# EasyEDA Pro project ProProject_powerboard_ssl_philipp_2023-09-25.epro, schematic Schematic1_9

## Sheets
1 P1: Create Date: 2022-11-08; Page Name: P1; Project Name: powerboard_ssl_philipp; Schematic Name: Schematic1_8; Update Date: 2023-06-18; Company: 嘉立创EDA; Page Size: A4; Version: V1.0
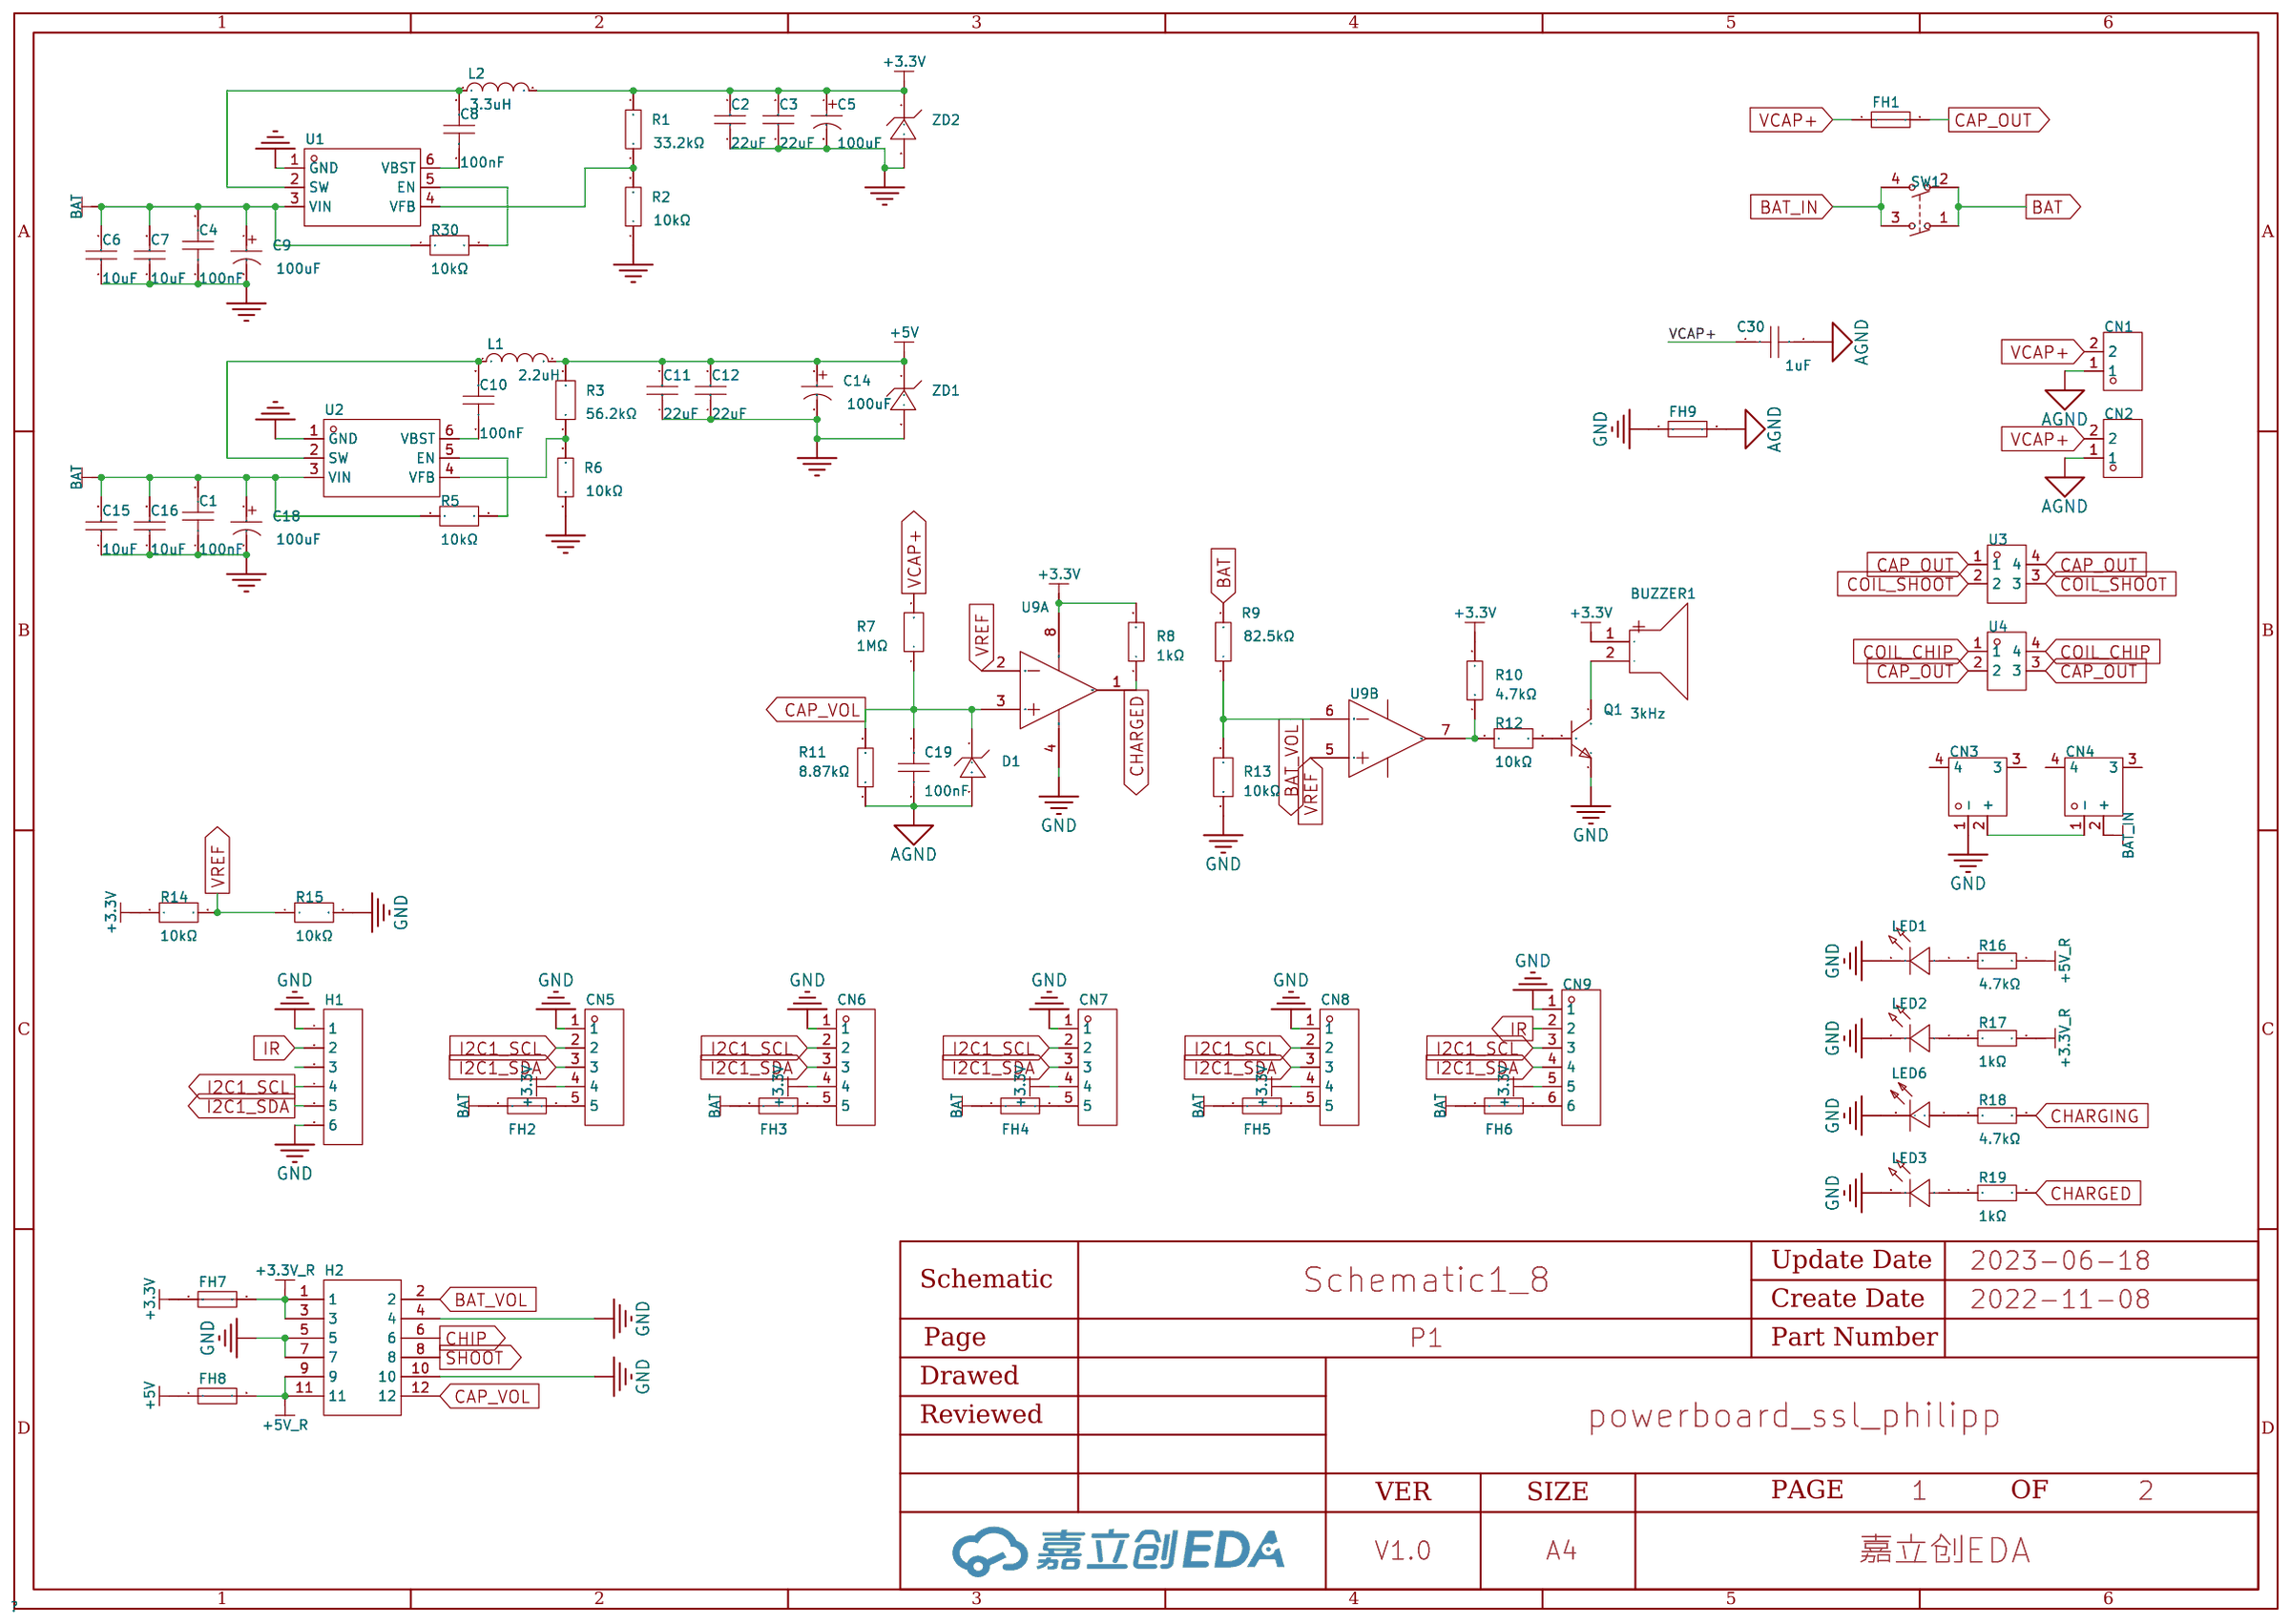
[diagram p6: P1]
2 P2: Create Date: 2022-11-11; Page Name: P2; Schematic Name: Schematic1_9; Update Date: 2023-07-16
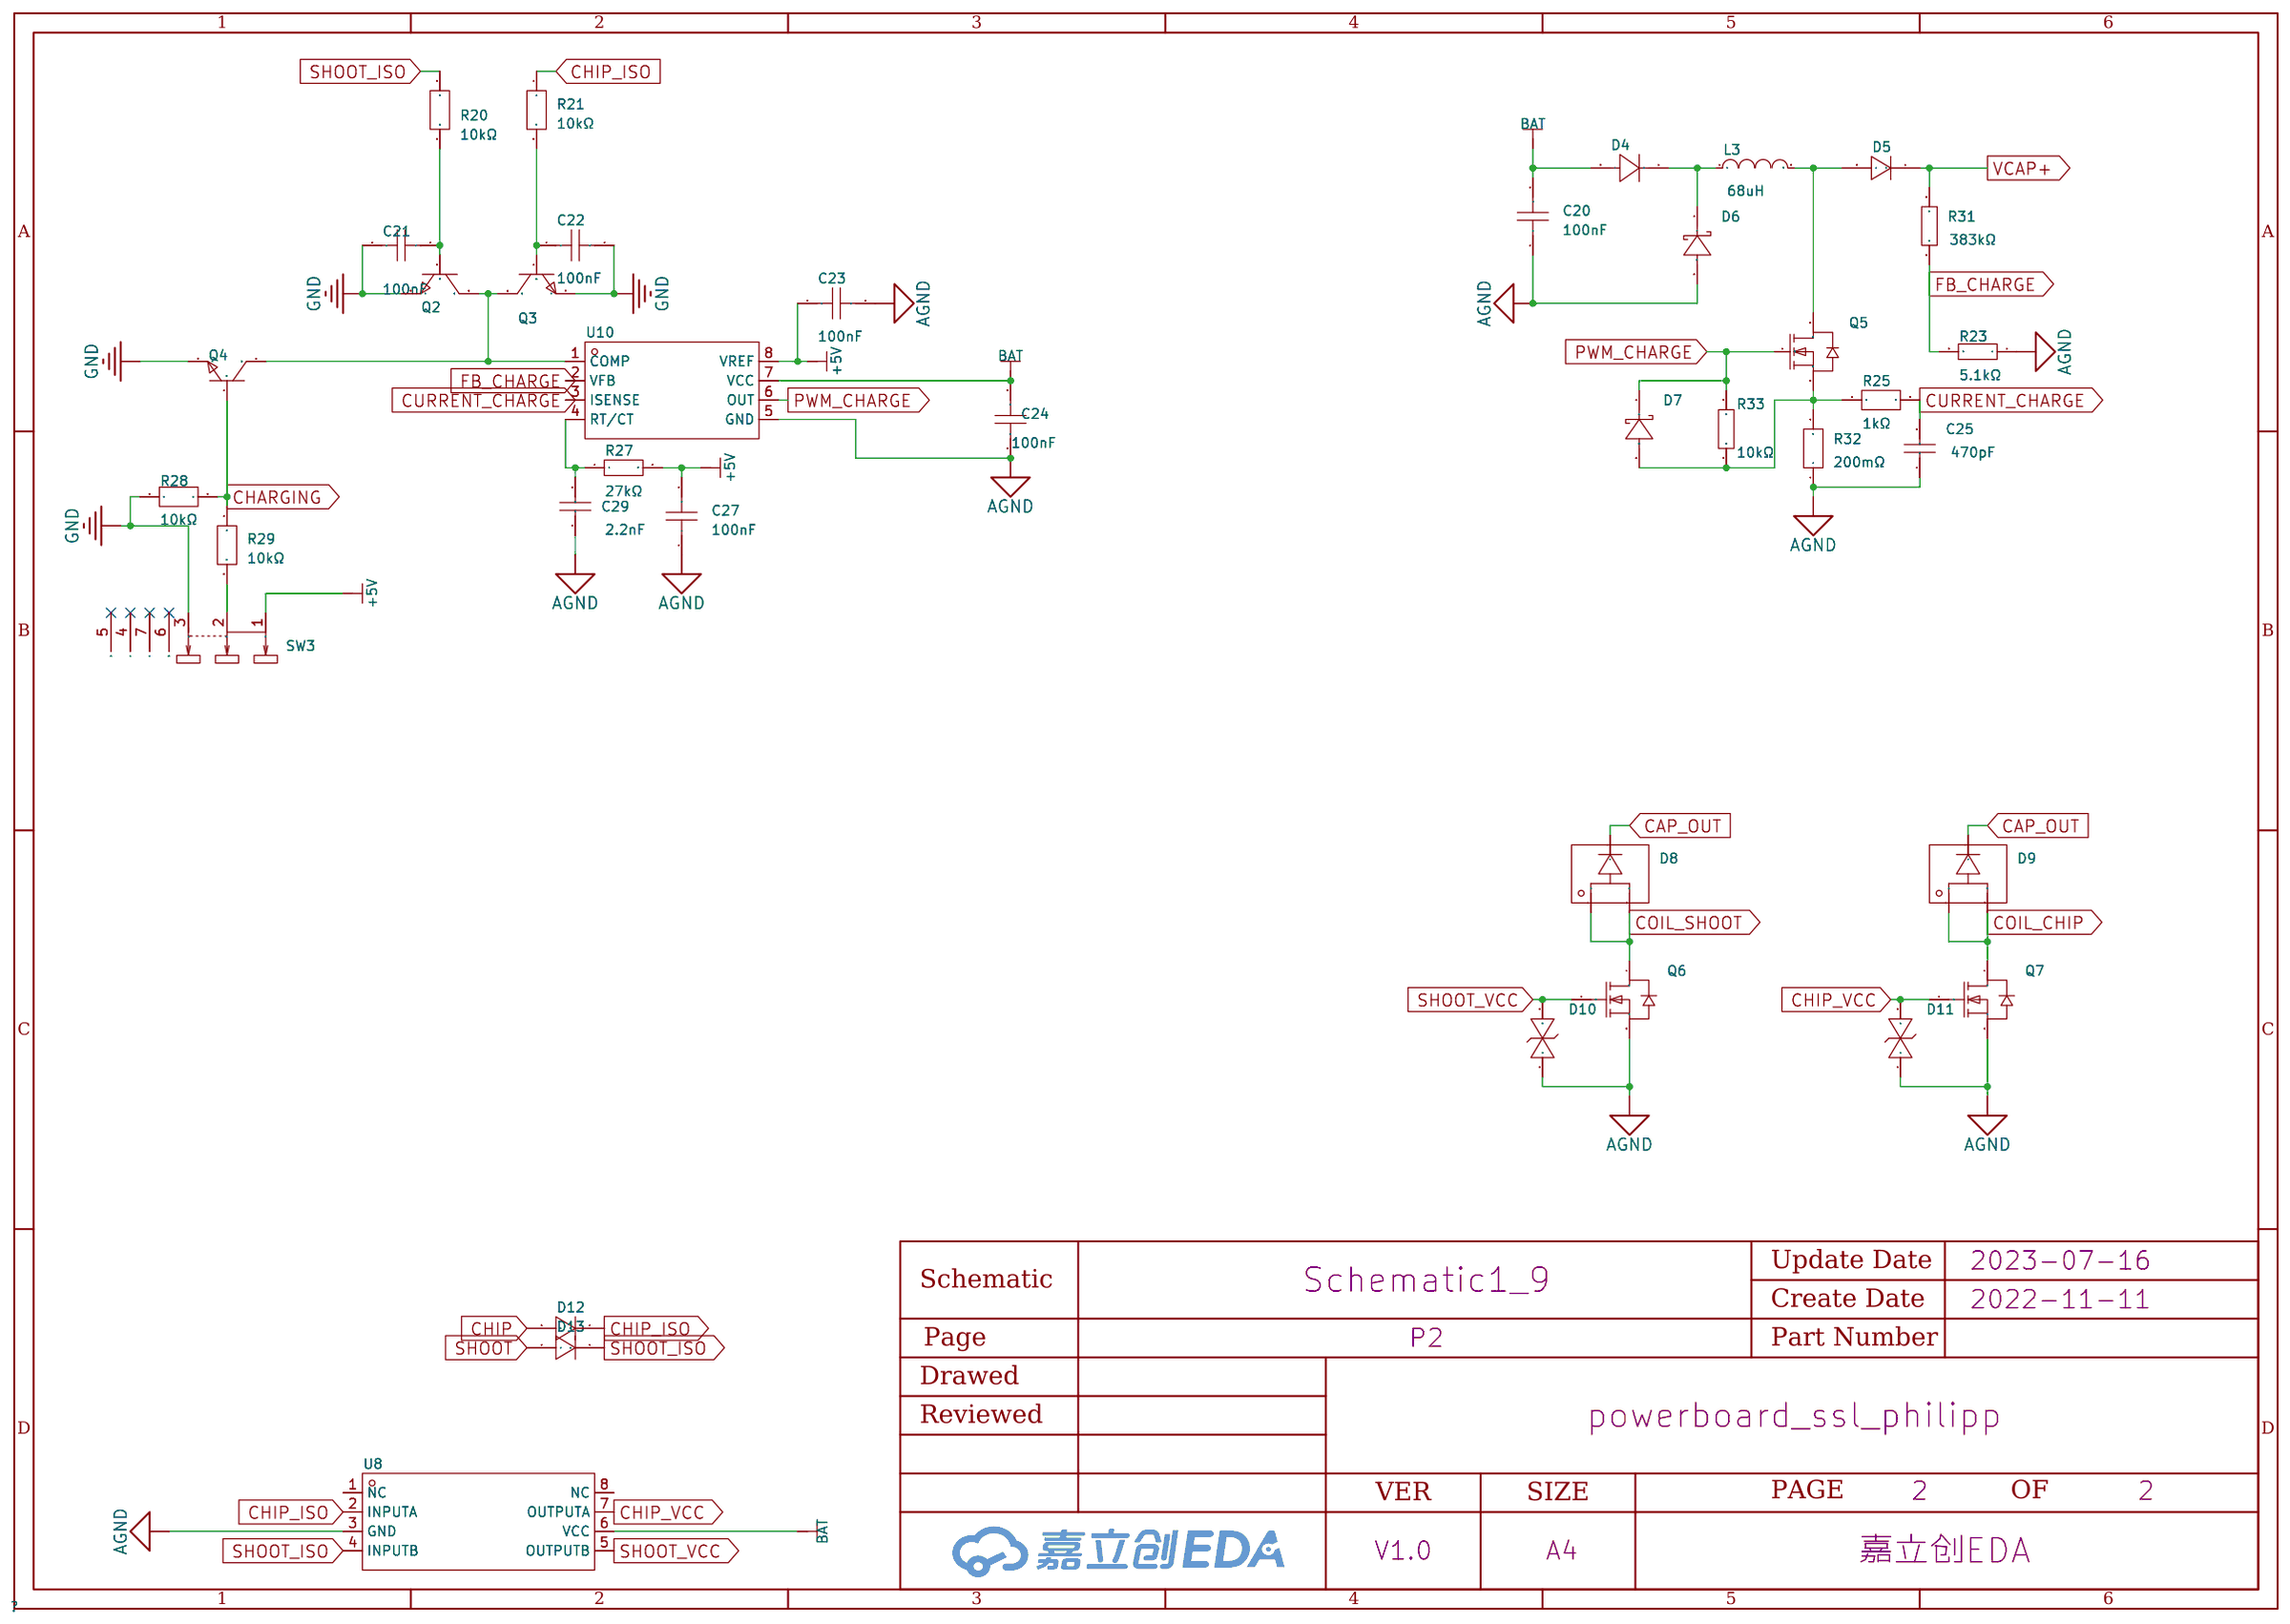
[diagram p7: P2]

## Parts
sheet P1
BUZZER1  3kHz  [BUZ-TH_BD9.0-P5.00-D0.6-FD]
C1  100nF  [C0805]
C2  22uF  [C0805]
C3  22uF  [C0805]
C4  100nF  [C0805]
C5  100uF  [CAP-TH_BD5.0-P2.00-D0.8-FD]
C6  10uF  [C0805]
C7  10uF  [C0805]
C8  100nF  [C0805]
C9  100uF  [CAP-TH_BD5.0-P2.00-D0.8-FD]
C10  100nF  [C0805]
C11  22uF  [C0805]
C12  22uF  [C0805]
C14  100uF  [CAP-TH_BD5.0-P2.00-D0.8-FD]
C15  10uF  [C0805]
C16  10uF  [C0805]
C18  100uF  [CAP-TH_BD5.0-P2.00-D0.8-FD]
C19  100nF  [C0805]
C30  1uF  [C1812]
CN1  OQ0254510000G  [CONN-TH_2P-P25.08_OQ0254510000G]
CN2  OQ0254510000G  [CONN-TH_2P-P25.08_OQ0254510000G]
CN3  XT60PW-M  [CONN-TH_XT60PW-M]
CN4  XT60PW-M  [CONN-TH_XT60PW-M]
CN5  5264-5AWD米色  [CONN-TH_5P-P2.50_5264-5AWD]
CN6  5264-5AWD米色  [CONN-TH_5P-P2.50_5264-5AWD]
CN7  5264-5AWD米色  [CONN-TH_5P-P2.50_5264-5AWD]
CN8  5264-5AWD米色  [CONN-TH_5P-P2.50_5264-5AWD]
CN9  HC-5264-6AW  [CONN-TH_6P-P2.50_HCTL_HC-5264-6AW]
D1  SMF3.3A  [SOD-123_L2.8-W1.8-LS3.7-RD]
FH1  01550900M  [FUSE-SMD_L9.8-W5.0]
FH2  01550900M  [FUSE-SMD_L9.8-W5.0]
FH3  01550900M  [FUSE-SMD_L9.8-W5.0]
FH4  01550900M  [FUSE-SMD_L9.8-W5.0]
FH5  01550900M  [FUSE-SMD_L9.8-W5.0]
FH6  01550900M  [FUSE-SMD_L9.8-W5.0]
FH7  01550900M  [FUSE-SMD_L9.8-W5.0]
FH8  01550900M  [FUSE-SMD_L9.8-W5.0]
FH9  01550900M  [FUSE-SMD_L9.8-W5.0]
H1  2.54-1x6P直针  [HDR-TH_6P-P2.54-V-M-1]
H2  A2541WV-2x6P  [HDR-TH_12P-P2.54-V-M-R2-C6-S2.54]
L1  2.2uH  [IND-SMD_L6.5-W6.5_IHLP-2525]
L2  3.3uH  [IND-SMD_L6.5-W6.5_IHLP-2525]
LED1  MHS171UBCT  [LED-SMD_L2.1-W1.0-R-RD]
LED2  MHS171UBCT  [LED-SMD_L2.1-W1.0-R-RD]
LED3  MHS171UBCT  [LED-SMD_L2.1-W1.0-R-RD]
LED6  SZYY0805B  [LED0805-R-RD_BLUE]
Q1  SS8050  [SOT-23-3_L2.9-W1.3-P1.90-LS2.4-BR]
R1  33.2kΩ  [R0805]
R2  10kΩ  [R0805]
R3  56.2kΩ  [R0805]
R5  10kΩ  [R0805]
R6  10kΩ  [R0805]
R7  1MΩ  [R0805]
R8  1kΩ  [R0805]
R9  82.5kΩ  [R0805]
R10  4.7kΩ  [R0805]
R11  8.87kΩ  [R0805]
R12  10kΩ  [R0805]
R13  10kΩ  [R0805]
R14  10kΩ  [R0805]
R15  10kΩ  [R0805]
R16  4.7kΩ  [R0805]
R17  1kΩ  [R0805]
R18  4.7kΩ  [R0805]
R19  1kΩ  [R0805]
R30  10kΩ  [R0805]
SW1  SS21-BBIWP2-R  [SW-TH_SS21-BBIWP2]
U1  TPS565208DDCR  [TSOT-23-6_L2.9-W1.6-P0.95-LS2.8-BR]
U2  TPS565208DDCR  [TSOT-23-6_L2.9-W1.6-P0.95-LS2.8-BR]
U3  2061-602/998-404  [CONN-SMD_2061-602-998-404]
U4  2061-602/998-404  [CONN-SMD_2061-602-998-404]
U9  LM393  [SOP-8_L4.9-W3.9-P1.27-LS6.0-BL]  (sections 1,2)
ZD1  BZT52C5V1  [SOD-123_L2.8-W1.8-LS3.7-RD]
ZD2  BZT52C3V3  [SOD-123_L2.8-W1.8-LS3.7-RD]
sheet P2
C20  100nF  [C0805]
C21  100nF  [C0805]
C22  100nF  [C0805]
C23  100nF  [C0805]
C24  100nF  [C0805]
C25  470pF  [C1206]
C27  100nF  [C0805]
C29  2.2nF  [C0805]
D4  GS2M  [SMB_L4.5-W3.6-LS5.4-RD]
D5  ES5EBF  [SMBF_L4.3-W3.6-LS5.3-RD]
D6  SMBJ18A  [SMB_L4.4-W3.6-LS5.4-RD]
D7  SMBJ18A  [SMB_L4.4-W3.6-LS5.4-RD]
D8  MBRB40250TG  [D2PAK_L9.1-W10.0-P2.54-LS15.3-BR]
D9  MBRB40250TG  [D2PAK_L9.1-W10.0-P2.54-LS15.3-BR]
D10  SMBJ17CA  [SMB_L4.6-W3.6-LS5.3-BI]
D11  SMBJ17CA  [SMB_L4.6-W3.6-LS5.3-BI]
D12  SS52  [SMB_L4.6-W3.6-LS5.3-RD]
D13  SS52  [SMB_L4.6-W3.6-LS5.3-RD]
L3  68uH  [IND-SMD_L14.4-W12.8]
Q2  SS8050  [SOT-23-3_L2.9-W1.3-P1.90-LS2.4-BR]
Q3  SS8050  [SOT-23-3_L2.9-W1.3-P1.90-LS2.4-BR]
Q4  SS8050  [SOT-23-3_L2.9-W1.3-P1.90-LS2.4-BR]
Q5  HSU16N25  [TO-252-2_L6.5-W5.6-P4.60-LS9.7-BR-2]
Q6  IRFS4229TRLPBF  [D2PAK_L9.1-W10.0-P2.54-LS15.3-TL]
Q7  IRFS4229TRLPBF  [D2PAK_L9.1-W10.0-P2.54-LS15.3-TL]
R20  10kΩ  [R0805]
R21  10kΩ  [R0805]
R23  5.1kΩ  [R1206]
R25  1kΩ  [R1206]
R27  27kΩ  [R1206]
R28  10kΩ  [R0805]
R29  10kΩ  [R0805]
R31  383kΩ  [R1206]
R32  200mΩ  [RES-SMD_L6.4-W3.2-R2512]
R33  10kΩ  [R1206]
SW3  K3-1296S-E1  [SW-TH_K3-1296S-E1]
U8  MC34152DG  [SOIC-8_L5.0-W4.0-P1.27-LS6.0-BL]
U10  UC3843BM/TR  [SOP-8_L4.9-W3.9-P1.27-LS6.0-BL]

## Library data of the parts
BUZZER1 = HNB09A03: 驱动方式:电磁式;构造类型:有源;额定电压:3V;工作电压:1.5V~4.5V;消耗电流:30mA;频率:3kHz;声压(SPL):85dB@10cm;直径(φD):9mm;长度:-;宽度:-;高度:5.5mm;工作温度:-20~+70;; LCSC Part Name: 电磁式有源一体蜂鸣器HNB09A03; Supplier Part: C96102; Manufacturer: 华能; Supplier Footprint: 插件,P=5mm; JLCPCB Part Class: Extended Part; Datasheet: https://atta.szlcsc.com/upload/public/pdf/source/20170522/1495448326172.pdf; Supplier: LCSC; Oscillator Circuit: 电磁式; Technology Type: 有源; Rated Voltage: 3V; Operating Voltage: 1.5V~4.5V; Current Consumption: 30mA; Sound Pressure Level (SPL): 85dB@10cm; Diameter (φD): 9mm; Height: 5.5mm; Operating Temperature: -20~+70
C1 C4 C8 C10 C19-C24 C27 = C0805X104K101T: 温度系数:X7R;容值:100nF;精度:±10%;额定电压:100V;; LCSC Part Name: 100nF(104) ±10% 100V; Supplier Part: C485772; Manufacturer: IHHEC(禾伸堂); Supplier Footprint: 0805; JLCPCB Part Class: Extended Part; Datasheet: https://atta.szlcsc.com/upload/public/pdf/source/20200117/C485772_1C2A03D89DC7D3F931FB9AFBA2903E68.pdf; Supplier: LCSC; Temperature Coefficient: X7R; Tolerance: ±10%; Voltage Rated: 100V
C2 C3 C11 C12 = GRM21BR61E226ME44L: 容值:22uF;精度:±20%;额定电压:25V;材质(温度系数):X5R;; LCSC Part Name: 22uF ±20% 25V; Supplier Part: C86816; Manufacturer: muRata(村田); Supplier Footprint: 0805; JLCPCB Part Class: Extended Part; Datasheet: https://atta.szlcsc.com/upload/public/pdf/source/20161226/1482720145536.pdf; Supplier: LCSC; Tolerance: ±20%; Voltage Rated: 25V; Temperature Coefficient: X5R
C5 C9 C14 C18 = 25YXJ100M5X11: 容值:100uF;精度:±20%;额定电压:25V;电容体直径:5mm;电容体长度:11mm;脚间距:2mm;纹波电流:250mA@100kHz;等效串联电阻:400mΩ@100kHz;工作寿命:5000hrs@105℃;; LCSC Part Name: 100uF ±20% 25V; Supplier Part: C108360; Manufacturer: rubycon(红宝石); Supplier Footprint: 插件,D5xL11mm; JLCPCB Part Class: Extended Part; Datasheet: https://atta.szlcsc.com/upload/public/pdf/source/20170418/1492506330752.pdf; Supplier: LCSC; Tolerance: ±20%; Rated Voltage: 25V; φD: 5mm; L: 11mm; Lead Spacing: 2mm; Ripple Current: 250mA@100kHz; Equivalent Series Resistance(ESR): 400mΩ@100kHz; Lifetime @ Temp: 5000hrs@105℃
C6 C7 C15 C16 = CL21A106KAYNNNE_C15850: 容值:10uF;精度:±10%;额定电压:25V;温度系数:X5R;; LCSC Part Name: 10uF ±10% 25V; Supplier Part: C15850; Manufacturer: SAMSUNG(三星); Manufacturer Part: CL21A106KAYNNNE; Supplier Footprint: 0805; JLCPCB Part Class: Basic Part; Datasheet: https://atta.szlcsc.com/upload/public/pdf/source/20160103/1457707679302.pdf; Supplier: LCSC; Tolerance: ±10%; Voltage Rated: 25V; Temperature Coefficient: X5R
C30 = FS43X105K251EGG: 容值:1uF;精度:±10%;额定电压:250V;材质(温度系数):X7R;; LCSC Part Name: 1uF ±10% 250V; Supplier Part: C381468; Manufacturer: PSA(信昌电陶); Supplier Footprint: 1812; JLCPCB Part Class: Extended Part; Datasheet: https://atta.szlcsc.com/upload/public/pdf/source/20190402/C381468_E502B8CF017A3D98B4DF4698605C68CE.pdf; Supplier: LCSC; Tolerance: ±10%; Voltage Rated: 250V; Temperature Coefficient: X7R
CN1 CN2 = OQ0254510000G: 参考系列:-;间距:5.08mm;插针结构:1x2P;排数:1;每排PIN数:2;行距:-;公母:公型插针;安装方式:弯插;额定电流:20A;工作温度范围:-40~+115;; LCSC Part Name: 2P 5.08mm; Supplier Part: C599410; Manufacturer: Amphenol; Supplier Footprint: 插件,P=5.08mm; JLCPCB Part Class: Extended Part; Datasheet: https://atta.szlcsc.com/upload/public/pdf/source/20210316/C599410_EA23387B2F1C07023878CDA6296B3C6F.pdf; Supplier: LCSC; Pitch: 5.08mm; Pins Structure: 1x2P; Number of Rows: 1; Number of PINs Per Row: 2; Gender: 公型插针; Mounting Style: 弯插; Current Rating (Max): 20A; Operating Temperature Range: -40~+115
CN3 CN4 = XT60PW-M: 模型锂电连接器; LCSC Part Name: XT60PW 公头 板插卧式; Supplier Part: C98732; Manufacturer: AMASS(艾迈斯); Supplier Footprint: Through Hole; JLCPCB Part Class: Extended Part; Datasheet: https://atta.szlcsc.com/upload/public/pdf/source/20180125/C98732_15168617837851301983.pdf; Supplier: LCSC
CN5-CN8 = 5264-5AWD米色: 参考系列:-;间距:2.5mm;插针结构:1x5P;排数:1;每排PIN数:5;行距:-;安装方式:-;触头材质:磷青铜;; LCSC Part Name: 5264插座 1*5P 弯针 带定位; Supplier Part: C176652; Manufacturer: BOOMELE(博穆精密); Supplier Footprint: 插件,P=2.5mm; JLCPCB Part Class: Extended Part; Datasheet: https://atta.szlcsc.com/upload/public/pdf/source/20180125/C176652_15168701824541304803.pdf; Supplier: LCSC; Pitch: 2.5mm; Pins Structure: 1x5P; Number of Rows: 1; Number of PINs Per Row: 5; Contact Material: 磷青铜
CN9 = HC-5264-6AW: 参考系列:-;间距:2.5mm;插针结构:1x6P;排数:1;每排PIN数:6;行距:-;公母:公型插针;安装方式:弯插;额定电流:3A;工作温度范围:-25~+85;; LCSC Part Name: 2.5mm 1x6P 弯插; Supplier Part: C2845829; Manufacturer: HCTL(华灿天禄); Supplier Footprint: 弯插,P=2.5mm; JLCPCB Part Class: Extended Part; Datasheet: https://atta.szlcsc.com/upload/public/pdf/source/20210728/C2845825_8A371A7E0B3DBB1209B365938FCC7945.pdf; Supplier: LCSC; Pitch: 2.5mm; Pins Structure: 1x6P; Number of Rows: 1; Number of PINs Per Row: 6; Gender: 公型插针; Mounting Style: 弯插; Current Rating (Max): 3A; Operating Temperature Range: -25~+85
D1 = SMF3.3A: 极性:单向;反向截止电压(Vrwm):3.3V;击穿电压(最小值):5.2V;击穿电压(最大值):6V;反向漏电流(Ir):600A;峰值脉冲电流(Ipp)@10/1000s:25A;最大钳位电压:8V;峰值脉冲功率(Ppp)@10/1000s:200W;; LCSC Part Name: 单向 3.3V 200W; Supplier Part: C283866; Manufacturer: DOWO(东沃); Supplier Footprint: SOD-123; JLCPCB Part Class: Extended Part; Datasheet: https://atta.szlcsc.com/upload/public/pdf/source/20180913/C283866_6B3FC7DB82D40F63EC323F6A8CE1774A.pdf; Supplier: LCSC; Polarity: 单向; Reverse Stand-Off Voltage (Vrwm): 3.3V; Breakdown Voltage (Min): 5.2V; Breakdown Voltage (Max): 6V; Reverse Leakage Current (Ir): 600A; Peak Pulse Current (Ipp)@10/1000μs: 25A; Maximum Clamping Voltage: 8V; Peak Pulse Power Dissipation (Ppp)@10/1000μs: 200W
FH1 FH7-FH9 = 01550900M: 保险丝座类型:-;保险丝类型:-;配套使用产品/相关产品:-;保险丝尺寸:-;电路数:-;; Supplier Part: C108518; Manufacturer: Littelfuse(美国力特); Supplier Footprint: SMD,9.73x5.03mm; JLCPCB Part Class: Extended Part; Datasheet: https://atta.szlcsc.com/upload/public/pdf/source/20180709/C108518_633006668DA33DEF5C52F8FE2F1C83D6.pdf; Supplier: LCSC
FH2-FH6 = 01550900M: 保险丝座类型:-;保险丝类型:-;保险丝尺寸:-;; Supplier Part: C108518; Manufacturer: Littelfuse(美国力特); Supplier Footprint: SMD,9.73x5.03mm; JLCPCB Part Class: Extended Part; Datasheet: https://atta.szlcsc.com/upload/public/pdf/source/20180709/C108518_633006668DA33DEF5C52F8FE2F1C83D6.pdf; Supplier: LCSC
H1 = 2.54-1x6P直针: 间距:2.54mm;总PIN位数:6;排数:1;插针结构:1x6P;行距:-;安装类型:直插;圆针/方针:方针;额定电流:3A;额定电压:-;配合针长度:-;塑高:-;触头材质:黄铜;触头镀层:-;工作温度范围:-40~+105;颜色:黑色;; LCSC Part Name: 2.54mm 1x6P 直插 方针; Supplier Part: C37208; Manufacturer: BOOMELE(博穆精密); Supplier Footprint: 直插,P=2.54mm; JLCPCB Part Class: Extended Part; Datasheet: https://atta.szlcsc.com/upload/public/pdf/source/20151109/1457707558014.pdf; Supplier: LCSC; Pitch: 2.54mm; Number of Pins: 6; Number of Rows: 1; Pin Structure: 1x6P; Mounting Type: 直插; Circluar Pins/Square Pins: 方针; Current Rating (Max): 3A; Contact Material: 黄铜; Operating Temperature Range: -40~+105; Color: 黑色
H2 = A2541WV-2x6P: 间距:2.54mm;总PIN位数:12;排数:2;插针结构:2x6P;行距:2.54mm;安装类型:直插;圆针/方针:方针;额定电流:-;额定电压:-;配合针长度:6mm;塑高:2.54mm;端接针长度:3mm;触头材质:黄铜;触头镀层:-;工作温度范围:-40~+105;颜色:黑色;; LCSC Part Name: 2.54mm 2x6P 直插 方针 镀金; Supplier Part: C225521; Manufacturer: CJT(长江连接器); Supplier Footprint: 插件,P=2.54mm; JLCPCB Part Class: Extended Part; Datasheet: https://atta.szlcsc.com/upload/public/pdf/source/20180509/C225521_5ACF74447E0551B122D29D93138E3088.pdf; Supplier: LCSC; Pitch: 2.54mm; Number of Pins: 12; Number of Rows: 2; Pin Structure: 2x6P; Row Spacing: 2.54mm; Mounting Type: 直插; Circluar Pins/Square Pins: 方针; Length of Mating Pin: 6mm; Insulation Height: 2.54mm; Length of End Connection Pin: 3mm; Contact Material: 黄铜; Operating Temperature Range: -40~+105; Color: 黑色
L1 = IHLP2525CZER2R2M01: 电感值:2.2uH;精度:±20%;额定电流:8A;饱和电流(Isat):14A;直流电阻(DCR):18mΩ;; LCSC Part Name: 2.2uH ±20% 14A 18mΩ; Supplier Part: C540967; Manufacturer: VISHAY(威世); Supplier Footprint: 2525; JLCPCB Part Class: Extended Part; Datasheet: https://atta.szlcsc.com/upload/public/pdf/source/20200518/C540965_C44D252D9586BC7DBEB4AC22742EA8B7.pdf; Supplier: LCSC; Tolerance: ±20%; Rated Current: 8A; Saturation Current (Isat): 14A; DC Resistance (DCR): 18mΩ; Frequency - Self Resonant: 38MHz
L2 = IHLP2525CZER3R3M01: 电感值:3.3uH;精度:±20%;额定电流:6A;直流电阻(DCR):28mΩ;; LCSC Part Name: 3.3uH ±20% 6A 28mΩ; Supplier Part: C506574; Manufacturer: VISHAY(威世); Supplier Footprint: SMD; JLCPCB Part Class: Extended Part; Datasheet: https://atta.szlcsc.com/upload/public/pdf/source/20200402/C506576_682BA61D3692E8732F3F8433B2832F66.pdf; Supplier: LCSC; Tolerance: ±20%; Rated Current: 6A; DC Resistance (DCR): 28mΩ
LED1-LED3 = MHS171UBCT: 发光颜色:蓝灯;二极管配置:-;透镜颜色:无色透明;主波长:467nm~476nm;峰值波长:468nm;色温:-;光通量(25时):-;测试电流:5mA;正向电压(VF):3.1V;发光强度:90mcd;功率:75mW;发光角度:140°;安装方式:侧贴;工作温度:-40~+85;; LCSC Part Name: 0805侧贴蓝色光; Supplier Part: C693906; Manufacturer: MEIHUA(美华); Supplier Footprint: 0805; JLCPCB Part Class: Extended Part; Datasheet: https://atta.szlcsc.com/upload/public/pdf/source/20200629/C693906_2892460FD04527E9A85093334938F5D1.pdf; Supplier: LCSC; Emitted Color: 蓝灯; Lens Color: 无色透明; Dominant Wavelength: 467nm~476nm; Peak Wavelength: 468nm; Forward Current: 5mA; Forward Voltage (VF): 3.1V; Luminous Intensity: 90mcd; Power Dissipation: 75mW; Viewing Angle: 140°; Mounting Sytle: 侧贴; Operating Temperature: -40~+85
LED6 = SZYY0805B: 发光颜色:蓝灯;二极管配置:-;透镜颜色:无色透明;主波长:460nm~475nm;峰值波长:469nm;色温:-;测试电流:5mA;功率:100mW;发光角度:120°;安装方式:-;工作温度:-40℃~+85℃;; LCSC Part Name: 蓝灯 460nm~475nm; Supplier Part: C434433; Manufacturer: yongyu(永裕光电); Supplier Footprint: 0805; JLCPCB Part Class: Extended Part; Datasheet: https://atta.szlcsc.com/upload/public/pdf/source/20191204/C434433_0B90CAB876449C52BDD12D5E48F83BBD.pdf; Supplier: LCSC; Emitted Color: 蓝灯; Lens Color: 无色透明; Dominant Wavelength: 460nm~475nm; Peak Wavelength: 469nm; Forward Current: 5mA; Power Dissipation: 100mW; Viewing Angle: 120°; Operating Temperature: -40℃~+85℃
Q1-Q4 = SS8050_C2150: 晶体管类型:NPN;集射极击穿电压(Vceo):25V;集电极电流(Ic):1.5A;功率(Pd):300mW;集电极-发射极饱和电压(VCE(sat)@Ic,Ib):500mV@800mA,80mA;直流电流增益(hFE@Ic,Vce):200@100mA,1V;特征频率(fT):100MHz;工作温度:+150@(Tj);; LCSC Part Name: SS8050 Y1 200-350 Y1 200-350; Supplier Part: C2150; Manufacturer: CJ(江苏长电/长晶); Supplier Footprint: SOT-23(SOT-23-3); JLCPCB Part Class: Basic Part; Datasheet: https://atta.szlcsc.com/upload/public/pdf/source/20140809/1457707209319.pdf; Supplier: LCSC; Transistor Type: NPN; Collector-Emitter Breakdown Voltage (Vceo): 25V; Collector Current (Ic): 1.5A; Power Dissipation (Pd): 300mW; Collector-Emitter Saturation Voltage (VCE(sat)@Ic,Ib): 500mV@800mA,80mA; DC Current Gain (hFE@Ic,Vce): 200@100mA,1V; Transition Frequency (fT): 100MHz; Operating Temperature: +150@(Tj)
R1 = RS-05K3322FT: 精度:±1%;阻值:33.2kΩ;温度系数:±100ppm/℃;功率:125mW;最大工作电压:150V;工作温度范围:-55℃~+155℃;; LCSC Part Name: 33.2KΩ(3322) ±1%; Supplier Part: C322426; Manufacturer: FH(风华); Supplier Footprint: 0805; JLCPCB Part Class: Extended Part; Datasheet: https://atta.szlcsc.com/upload/public/pdf/source/20181123/C322426_6865F9F5F6028054B6F91B3BBB90373B.pdf; Supplier: LCSC; Tolerance: ±1%; Temperature Coefficient: ±100ppm/℃; Power(Watts): 125mW; Overload Voltage (Max): 150V; Operating Temperature Range: -55℃~+155℃
R2 R6 = 0805W8F1002T5E_C17414: 精度:±1%;温度系数:±100ppm/℃;阻值:10kΩ;功率:1/8W;最大工作电压:150V;工作温度范围:-55℃~+155℃;; LCSC Part Name: 10KΩ ±1%; Supplier Part: C17414; Manufacturer: UNI-ROYAL(厚声); Manufacturer Part: 0805W8F1002T5E; Supplier Footprint: 0805; JLCPCB Part Class: Basic Part; Datasheet: https://atta.szlcsc.com/upload/public/pdf/source/20170920/C17414_1505887067106979773.pdf; Supplier: LCSC; Tolerance: ±1%; Temperature Coefficient: ±100ppm/℃; Power(Watts): 1/8W; Overload Voltage (Max): 150V; Operating Temperature Range: -55℃~+155℃
R3 = RK73H2ATTD5622F: 电阻类型:厚膜电阻;阻值:56.2kΩ;精度:±1%;功率:250mW;温度系数:±100ppm/℃;工作温度范围:-55℃~+155℃;; LCSC Part Name: 56.2kΩ ±1% 250mW; Supplier Part: C830394; Manufacturer: KOA; Supplier Footprint: 0805; JLCPCB Part Class: Extended Part; Datasheet: https://atta.szlcsc.com/upload/public/pdf/source/20190516/C346145_73DC9C40D36D5A63BE57BD2EFB7F1781.pdf; Supplier: LCSC; Type: 厚膜电阻; Tolerance: ±1%; Power(Watts): 250mW; Temperature Coefficient: ±100ppm/℃; Operating Temperature Range: -55℃~+155℃
R5 R12-R15 R20 R21 R28-R30 = ARG05FTD1002: 阻值:10kΩ;精度:±1%;温度系数:±50ppm/;; LCSC Part Name: 10kΩ ±1%; Supplier Part: C2828859; Manufacturer: Viking(光颉); Supplier Footprint: 0805; JLCPCB Part Class: Extended Part; Datasheet: https://atta.szlcsc.com/upload/public/pdf/source/20200117/C485675_99063924B4564AF910B7BE66DA8EFA49.pdf; Supplier: LCSC; Tolerance: ±1%; Temperature Coefficient: ±50ppm/
R7 = CR0805F1M00P05Z: 阻值:1MΩ;精度:±1%;功率:125mW;温度系数:±100ppm/;; LCSC Part Name: 1MΩ ±1% 125mW; Supplier Part: C881016; Manufacturer: EVER OHMS(天二科技); Supplier Footprint: 0805; JLCPCB Part Class: Extended Part; Datasheet: https://atta.szlcsc.com/upload/public/pdf/source/20201014/C881429_ABC29D63C8D6A11EB63D87348B25AA7B.pdf; Supplier: LCSC; Tolerance: ±1%; Power(Watts): 125mW; Temperature Coefficient: ±100ppm/
R8 R17 R19 = QR0805F1K00P05Z: 电阻类型:厚膜电阻;阻值:1kΩ;精度:±1%;功率:125mW;温度系数:±100ppm/;最大工作电压:150V;工作温度范围:-55~+155;; LCSC Part Name: 1kΩ ±1%; Supplier Part: C176197; Manufacturer: EVER OHMS(天二科技); Supplier Footprint: 0805; JLCPCB Part Class: Extended Part; Datasheet: https://atta.szlcsc.com/upload/public/pdf/source/20190415/C176197_C60CBF18F0A7636F3DFA0D4EFA05F988.pdf; Supplier: LCSC; Type: 厚膜电阻; Tolerance: ±1%; Power(Watts): 125mW; Temperature Coefficient: ±100ppm/; Overload Voltage (Max): 150V; Operating Temperature Range: -55~+155
R9 = 0805W8F8252T5E: 电阻类型:厚膜电阻;阻值:82.5kΩ;精度:±1%;功率:125mW;温度系数:±100ppm/;最大工作电压:150V;工作温度范围:-55~+155;; LCSC Part Name: 82.5kΩ ±1% 125mW; Supplier Part: C17835; Manufacturer: UNI-ROYAL(厚声); Supplier Footprint: 0805; JLCPCB Part Class: Extended Part; Datasheet: https://atta.szlcsc.com/upload/public/pdf/source/20200306/C422600_1E6D84923E4A46A82E41ADD87F860B5C.pdf; Supplier: LCSC; Type: 厚膜电阻; Tolerance: ±1%; Power(Watts): 125mW; Temperature Coefficient: ±100ppm/; Overload Voltage (Max): 150V; Operating Temperature Range: -55~+155
R10 R16 R18 = RMC08054.7K1%N: 阻值:4.7kΩ;精度:±1%;功率:125mW;; LCSC Part Name: 4.7kΩ ±1% 125mW; Supplier Part: C269746; Manufacturer: Tyohm(幸亚电阻); Supplier Footprint: 0805; JLCPCB Part Class: Extended Part; Datasheet: https://atta.szlcsc.com/upload/public/pdf/source/20190115/C269746_3EA3C7E4490C68712FA44CA03852E2BD.pdf; Supplier: LCSC; Tolerance: ±1%; Power(Watts): 125mW
R11 = RTT058871FTP: 电阻类型:厚膜电阻;阻值:8.87kΩ;精度:±1%;功率:125mW;温度系数:±100ppm/;最大工作电压:150V;工作温度范围:-55~+155;; LCSC Part Name: 8.87kΩ ±1% 125mW; Supplier Part: C104543; Manufacturer: RALEC(旺诠); Supplier Footprint: 0805; JLCPCB Part Class: Extended Part; Datasheet: https://atta.szlcsc.com/upload/public/pdf/source/20170408/1491646636381.pdf; Supplier: LCSC; Type: 厚膜电阻; Tolerance: ±1%; Power(Watts): 125mW; Temperature Coefficient: ±100ppm/; Overload Voltage (Max): 150V; Operating Temperature Range: -55~+155
SW1 = SS21-BBIWP2-R: LCSC Part Name: 跷板开关DPST 15x21mm; Supplier Part: C309182; Manufacturer: Legion(六钧); Supplier Footprint: 插件; JLCPCB Part Class: Extended Part; Datasheet: https://atta.szlcsc.com/upload/public/pdf/source/20190311/C309182_BE3155CDE2291F8D537E9264D9294CC5.pdf; Supplier: LCSC
U1 U2 = TPS565208DDCR: 功能类型:降压型;同步整流:是;输出类型:可调;输出通道数:1;拓扑结构:降压式;输入电压:4.5V~17V;输出电压:760mV~7V;输出电流(最大值):5A;开关频率:500kHz;工作温度:-40℃~+125℃@(TJ);; LCSC Part Name: 降压型 Vin=4.5V~17V Vout=760mV~7V 5A; Supplier Part: C2650336; Manufacturer: TI(德州仪器); Supplier Footprint: TSOT-23-6; JLCPCB Part Class: Extended Part; Datasheet: https://atta.szlcsc.com/upload/public/pdf/source/20230228/45E26973952C09D7495BCE5F9104F99B.pdf; Supplier: LCSC; Function: 降压型; Synchronous Rectification: 是; Output Type: 可调; Number of Outputs: 1; Topology: 降压式; Input Voltage: 4.5V~17V; Output Voltage: 760mV~7V; Output Current (Max): 5A; Switching Frequency: 500kHz; Operating Temperature: -40℃~+125℃@(TJ)
U3 U4 = 2061-602/998-404: 间距:6mm;每排PIN数:2;排数:1;安装类型:表面贴装;额定电流:-;额定电压:-;线规 - AWG:-;线规 - mm²:-;工作温度范围:-60~+105;颜色:白色;; LCSC Part Name: 6mm 每排P数:2 排数:1; Supplier Part: C2765058; Manufacturer: WAGO(万可); Supplier Footprint: P=6mm; JLCPCB Part Class: Extended Part; Datasheet: https://atta.szlcsc.com/upload/public/pdf/source/20210406/C2765058_42F16AD0A4D4755D149E55C8B45DF4E1.pdf; Supplier: LCSC; Pitch: 6mm; Number of PINs Per Row: 2; Number of Rows: 1; Mounting Style: 表面贴装; Operating Temperature Range: -60~+105; Color: 白色
U9 = LM393_C400839: 比较器组数:-;电源电压:-;各通道供电电流:-;输出类型:-;传播延迟:-;; Supplier Part: C400839; Manufacturer: IDCHIP(英锐芯); Supplier Footprint: SOP-8; JLCPCB Part Class: Extended Part; Datasheet: https://atta.szlcsc.com/upload/public/pdf/source/20190624/C400839_FC3E4757065A64BC24F9F0B8EF99EFFB.pdf; Supplier: LCSC
ZD1 = BZT52C5V1_C2117: 二极管配置:独立式;稳压值(标称值):5.1V;稳压值(范围):4.8V~5.4V;精度:-;功率:350mW;反向电流(Ir):2uA@2V;阻抗(Zzt):60Ω;; LCSC Part Name: 5.1V 350mW W8; Supplier Part: C2117; Manufacturer: CJ(江苏长电/长晶); Supplier Footprint: SOD-123; JLCPCB Part Class: Extended Part; Datasheet: https://atta.szlcsc.com/upload/public/pdf/source/20140809/1457707207957.pdf; Supplier: LCSC; Diode Configuration: 独立式; Zener Voltage (Nom): 5.1V; Zener Voltage (Range): 4.8V~5.4V; Power Dissipation: 350mW; Reverse Leakage Current (Ir): 2uA@2V; Zener Impedance (Zzt): 60Ω
ZD2 = BZT52C3V3_C2112: 二极管配置:独立式;稳压值(标称值):3.3V;稳压值(范围):3.1V~3.5V;精度:-;功率:350mW;反向电流(Ir):5uA@1V;阻抗(Zzt):95Ω;; LCSC Part Name: 3.3V 350mW; Supplier Part: C2112; Manufacturer: CJ(江苏长电/长晶); Supplier Footprint: SOD-123; JLCPCB Part Class: Extended Part; Datasheet: https://atta.szlcsc.com/upload/public/pdf/source/20170919/C2112_1505799672426977594.pdf; Supplier: LCSC; Diode Configuration: 独立式; Zener Voltage (Nom): 3.3V; Zener Voltage (Range): 3.1V~3.5V; Power Dissipation: 350mW; Reverse Leakage Current (Ir): 5uA@1V; Zener Impedance (Zzt): 95Ω
C25 = CC1206KKX7RCBB471: 容值:470pF;精度:±10%;额定电压:1kV;材质(温度系数):X7R;; LCSC Part Name: 470pF ±10% 1kV; Supplier Part: C107197; Manufacturer: YAGEO(国巨); Supplier Footprint: 1206; JLCPCB Part Class: Extended Part; Datasheet: https://atta.szlcsc.com/upload/public/pdf/source/20170420/1492670778345.pdf; Supplier: LCSC; Tolerance: ±10%; Voltage Rated: 1kV; Temperature Coefficient: X7R
C29 = 0805B222K500NT: 容值:2.2nF;精度:±10%;额定电压:50V;材质(温度系数):X7R;; LCSC Part Name: 2.2nF ±10% 50V; Supplier Part: C36576; Manufacturer: FH(风华); Supplier Footprint: 0805; JLCPCB Part Class: Extended Part; Datasheet: https://atta.szlcsc.com/upload/public/pdf/source/20170923/C36576_1506149442840988737.pdf; Supplier: LCSC; Tolerance: ±10%; Voltage Rated: 50V; Temperature Coefficient: X7R
D4 = GS2M_C698618: 二极管配置:独立式;直流反向耐压(Vr):1.2kV;平均整流电流(Io):2A;正向压降(Vf):1.15V@2A;反向电流(Ir):5A@1.2kV;; LCSC Part Name: 1.2kV 2A 1.15V@2A; Supplier Part: C698618; Manufacturer: YANGJIE(扬杰); Supplier Footprint: SMB(DO-214AA); JLCPCB Part Class: Extended Part; Datasheet: https://atta.szlcsc.com/upload/public/pdf/source/20200713/C698618_86B926E1828E5318C037A757CDD1E7A6.pdf; Supplier: LCSC; Diode Configuration: 独立式; Reverse Voltage (Vr): 1.2kV; Average Rectified Current (Io): 2A; Forward Voltage (Vf@If): 1.15V@2A; Reverse Leakage Current: 5A@1.2kV
D5 = ES5EBF: 正向压降(Vf):1.25V 5A;工作温度(最大值):+150℃ (Tj);平均整流电流(Io):5A;直流反向耐压(Vr):300V;反向电流(Ir):10A 300V;反向恢复时间(trr):35ns;工作温度(最小值):-55℃ (Tj);二极管配置:独立式;; Supplier Part: C116108; Manufacturer: 晶导微电子; Supplier Footprint: SMBF; JLCPCB Part Class: Extended Part; Datasheet: https://atta.szlcsc.com/upload/public/pdf/source/20170630/1498816634891.pdf; Supplier: LCSC; Forward Voltage (Vf@If): 1.25V 5A; Operating Temperature (Max): +150℃ (Tj); Average Rectified Current (Io): 5A; Reverse Voltage (Vr): 300V; Reverse Leakage Current: 10A 300V; Reverse Recovery Time (trr): 35ns; Operating Temperature (Min): -55℃ (Tj); Diode Configuration: 独立式
D6 D7 = SMBJ18A_C693494: 极性:单向;反向截止电压(Vrwm):18V;击穿电压(最小值):29.2V;峰值脉冲电流(Ipp)@10/1000s:20.6A;最大钳位电压:29.2V;; LCSC Part Name: 单向 18V; Supplier Part: C693494; Manufacturer: FTR(乔光电子); Supplier Footprint: SMB(DO-214AA); JLCPCB Part Class: Extended Part; Datasheet: https://atta.szlcsc.com/upload/public/pdf/source/20200701/C693490_2A1922FF33BB98835C22E740F3EF18EC.pdf; Supplier: LCSC; Polarity: 单向; Reverse Stand-Off Voltage (Vrwm): 18V; Breakdown Voltage (Min): 29.2V; Peak Pulse Current (Ipp)@10/1000μs: 20.6A; Maximum Clamping Voltage: 29.2V
D8 D9 = MBRB40250TG: 直流反向耐压(Vr):250V;平均整流电流(Io):40A;正向压降(Vf):970mV@40A;; LCSC Part Name: MBRB40250TG: Schottky Power Rectifier, Switch-mode, 40 A, 250 V; Supplier Part: C480682; Manufacturer: onsemi(安森美); Supplier Footprint: D2PAK; JLCPCB Part Class: Extended Part; Datasheet: https://atta.szlcsc.com/upload/public/pdf/source/20200107/C480682_A322012E1593558B56C3AAF032477157.pdf; Supplier: LCSC; Reverse Voltage (Vr): 250V; Average Rectified Current (Io): 40A; Forward Voltage (Vf@If): 970mV@40A
D10 D11 = SMBJ17CA_C726866: 极性:双向;; LCSC Part Name: 双向; Supplier Part: C726866; Manufacturer: TWGMC(台湾迪嘉); Supplier Footprint: SMB; JLCPCB Part Class: Extended Part; Datasheet: https://atta.szlcsc.com/upload/public/pdf/source/20200901/C726811_07201DC3516E92FF13903A0BAE18F725.pdf; Supplier: LCSC; Polarity: 双向
D12 D13 = SS52_C51497: 二极管配置:-;直流反向耐压(Vr):20V;平均整流电流(Io):5A;正向压降(Vf):550mV@5A;反向电流(Ir):500uA@20V;; LCSC Part Name: 20V 5A 550mV@5A; Supplier Part: C51497; Manufacturer: MDD; Supplier Footprint: SMB(DO-214AA); JLCPCB Part Class: Extended Part; Datasheet: https://atta.szlcsc.com/upload/public/pdf/source/20190304/C51497_B9DE88D30138A91DB5F19D3E2A2AA480.pdf; Supplier: LCSC; Reverse Voltage (Vr): 20V; Average Rectified Current (Io): 5A; Forward Voltage (Vf@If): 550mV@5A; Reverse Leakage Current: 500uA@20V
L3 = SLO1365H680MTT: 电感值:68uH;精度:±20%;额定电流:2.5A;直流电阻(DCR):95mΩ;; LCSC Part Name: 68uH ±20% 2.5A 95mΩ; Supplier Part: C364092; Manufacturer: Sunltech(韩国顺磁); Supplier Footprint: SMD; JLCPCB Part Class: Extended Part; Datasheet: https://atta.szlcsc.com/upload/public/pdf/source/20190124/C364092_3F489F02B0CA9A320996494713968D51.pdf; Supplier: LCSC; Tolerance: ±20%; Rated Current: 2.5A; DC Resistance (DCR): 95mΩ
Q5 = HSU16N25: 类型:N沟道;漏源电压(Vdss):250V;连续漏极电流(Id):16A;功率(Pd):35W;导通电阻(RDS(on)@Vgs,Id):250mΩ@10V,8A;阈值电压(Vgs(th)@Id):4.0V@250A;; LCSC Part Name: N沟道 250V 16A; Supplier Part: C845615; Manufacturer: HUASHUO(华朔); Supplier Footprint: TO-252; JLCPCB Part Class: Extended Part; Datasheet: https://atta.szlcsc.com/upload/public/pdf/source/20201013/C845615_DFBA45AB3989AC818C53D1908ECC7454.pdf; Supplier: LCSC; Type: N沟道; Drain Source Voltage (Vdss): 250V; Continuous Drain Current (Id): 16A; Power Dissipation (Pd): 35W; Drain Source On Resistance (RDS(on)@Vgs,Id): 250mΩ@10V,8A; Gate Threshold Voltage (Vgs(th)@Id): 4.0V@250A
Q6 Q7 = IRFS4229TRLPBF: 类型:N沟道;漏源电压(Vdss):250V;连续漏极电流(Id):45A;功率(Pd):330W;导通电阻(RDS(on)@Vgs,Id):48mΩ@10V,26A;阈值电压(Vgs(th)@Id):2.4V@39A;; LCSC Part Name: N沟道 250V 45A; Supplier Part: C538018; Manufacturer: Infineon(英飞凌); Supplier Footprint: D2PAK; JLCPCB Part Class: Extended Part; Datasheet: https://atta.szlcsc.com/upload/public/pdf/source/20200525/C538018_98AAC0ECC47916D06978020247764DBD.pdf; Supplier: LCSC; Type: N沟道; Drain Source Voltage (Vdss): 250V; Continuous Drain Current (Id): 45A; Power Dissipation (Pd): 330W; Drain Source On Resistance (RDS(on)@Vgs,Id): 48mΩ@10V,26A; Gate Threshold Voltage (Vgs(th)@Id): 2.4V@39A
R23 = RMC12065.1K1%N: 阻值:5.1kΩ;精度:±1%;功率:250mW;; LCSC Part Name: 5.1kΩ ±1% 250mW; Supplier Part: C325932; Manufacturer: Tyohm(幸亚电阻); Supplier Footprint: 1206; JLCPCB Part Class: Extended Part; Datasheet: https://atta.szlcsc.com/upload/public/pdf/source/20190115/C325932_B7F1D57DC8EA01BCBCABEF363C402854.pdf; Supplier: LCSC; Tolerance: ±1%; Power(Watts): 250mW
R25 = HV06W4F1001T5E: 精度:±1%;温度系数:±100ppm/;功率:1/4W;阻值:1kΩ;最大工作电压:500V;工作温度范围:-55~+155;; LCSC Part Name: 1KΩ ±1%; Supplier Part: C414808; Manufacturer: UNI-ROYAL(厚声); Supplier Footprint: 1206; JLCPCB Part Class: Extended Part; Datasheet: https://atta.szlcsc.com/upload/public/pdf/source/20190827/C414808_28BD918F26DF150E6C191E0EFB710C5D.pdf; Supplier: LCSC; Tolerance: ±1%; Temperature Coefficient: ±100ppm/; Power(Watts): 1/4W; Overload Voltage (Max): 500V; Operating Temperature Range: -55~+155
R27 = WR12X2702FTL: 阻值:27kΩ;精度:±1%;功率:250mW;温度系数:±100ppm/;最大工作电压:200V;工作温度范围:-55~+155;; LCSC Part Name: 27kΩ ±1%; Supplier Part: C171077; Manufacturer: 华新科(Walsin); Supplier Footprint: 1206; JLCPCB Part Class: Extended Part; Datasheet: https://atta.szlcsc.com/upload/public/pdf/source/20180125/C171077_15168698985411304382.pdf; Supplier: LCSC; Tolerance: ±1%; Power(Watts): 250mW; Temperature Coefficient: ±100ppm/; Overload Voltage (Max): 200V; Operating Temperature Range: -55~+155
R31 = 1206W4F3833T5E: 电阻类型:厚膜电阻;阻值:383kΩ;精度:±1%;功率:250mW;; LCSC Part Name: 383kΩ ±1% 250mW; Supplier Part: C247277; Manufacturer: UNI-ROYAL(厚声); Supplier Footprint: 1206; JLCPCB Part Class: Extended Part; Datasheet: https://atta.szlcsc.com/upload/public/pdf/source/20200306/C422600_1E6D84923E4A46A82E41ADD87F860B5C.pdf; Supplier: LCSC; Type: 厚膜电阻; Tolerance: ±1%; Power(Watts): 250mW; Temperature Coefficient: ±100ppm/℃; Overload Voltage (Max): 200V; Operating Temperature Range: -55℃~+155℃
R32 = HoJLR2512-3W-200mR-1%: 阻值:200mΩ;精度:±1%;功率:3W;温度系数:±50ppm/℃;工作温度范围:-50℃~+170℃;; LCSC Part Name: 200mΩ ±1% 3W; Supplier Part: C2903473; Manufacturer: Milliohm(毫欧); Supplier Footprint: 2512; JLCPCB Part Class: Extended Part; Datasheet: https://atta.szlcsc.com/upload/public/pdf/source/20211009/7525CABAB363C979E942C1DD41F1FEF0.pdf; Supplier: LCSC; Tolerance: ±1%; Power(Watts): 3W; Temperature Coefficient: ±50ppm/℃; Operating Temperature Range: -50℃~+170℃
R33 = 1206W4F1002T5E: 电阻类型:厚膜电阻;阻值:10kΩ;精度:±1%;功率:250mW;; LCSC Part Name: 10kΩ ±1% 250mW; Supplier Part: C17902; Manufacturer: UNI-ROYAL(厚声); Supplier Footprint: 1206; JLCPCB Part Class: Basic Part; Datasheet: https://atta.szlcsc.com/upload/public/pdf/source/20200306/C422600_1E6D84923E4A46A82E41ADD87F860B5C.pdf; Supplier: LCSC; Type: 厚膜电阻; Tolerance: ±1%; Power(Watts): 250mW; Temperature Coefficient: ±100ppm/℃; Overload Voltage (Max): 200V; Operating Temperature Range: -55℃~+155℃
SW3 = K3-1296S-E1: 额定电流(DC):300mA;额定电压(DC):4V;额定电流(AC):-;额定电压(AC):-;电路结构:单刀双掷;安装方式:卧贴;机械寿命:10000;开关颜色:黑色;滑钮形状:矩形柱状;引脚样式:SMD接片;工作温度:-25℃~+80℃;开关长度:6.6mm;开关宽度:2.7mm;开关高度:1.4mm;; LCSC Part Name: 1P2T 柄长1.5 侧拨开关 6.7mm*2.6mm 带固定柱; Supplier Part: C128955; Manufacturer: 韩国韩荣; Supplier Footprint: SMD; JLCPCB Part Class: Extended Part; Datasheet: https://atta.szlcsc.com/upload/public/pdf/source/20210810/891A308926761427C641228111E8C4D0.pdf; Supplier: LCSC; Current Rating (DC): 300mA; Voltage Rating (DC): 4V; Circuit: 单刀双掷; Mounting Style: 卧贴; Mechanical Life: 10000; Actuator Color: 黑色; Actuator Style: 矩形柱状; Pin Style: SMD接片; Operating Temperature: -25℃~+80℃; Switch Length: 6.6mm; Switch Width: 2.7mm; Switch Height: 1.4mm
U8 = MC34152DG: MC34152/MC33152 是双路非逆向高速驱动器，专门设计用于需要低电流数字信号以高压摆率驱动大电容负载的应用。这些器件具有低输入电流因此可兼容 CMOS/LSTTL 逻辑，输入迟滞实现快速输出开关而不受输入转换时间影响，还有两路高电流图腾柱输出，极其适用于驱动功率 MOSFET。另外还包括带有迟滞的欠压锁定，以防系统在低电源电压下错误运行。典型应用包括开关电源、DC-DC 转换器、电容电荷泵倍压器/逆变器和电机控制器。此器件采用双列直插和表面贴装封装。; Supplier Part: C236137; Manufacturer: onsemi(安森美); Supplier Footprint: SOIC-8_150mil; JLCPCB Part Class: Extended Part; Datasheet: https://atta.szlcsc.com/upload/public/pdf/source/20181113/C236137_C17D0EAAFF06BB1704B541C92D239A78.pdf; Supplier: LCSC
U10 = UC3843BM/TR: 电流模式PWM控制器; Supplier Part: C2987350; Manufacturer: HGSEMI(华冠); Supplier Footprint: SOP-8; JLCPCB Part Class: Extended Part; Datasheet: https://atta.szlcsc.com/upload/public/pdf/source/20220406/1010CC7FB2B129E1616D2257145C6E1B.pdf; Supplier: LCSC

## Nets
+3.3V: BUZZER1.1(+) C2.2 C3.2 C5.1 CN5.4 CN6.4 CN7.4 CN8.4 CN9.5 FH7.1 L2.2 R1.2 R8.2 R10.2 R14.1 U9.8(VCC) ZD2.1(K)
+3.3V_R: FH7.2 H2.1 H2.3 R17.2
+5V: C11.2 C12.2 C14.1 C23.1 C27.2 FH8.1 L1.2 R3.2 R27.2 SW3.1 U10.8(VREF) ZD1.1(K)
+5V_R: FH8.2 H2.9 H2.11 R16.1
AGND: C19.1 C20.1 C23.2 C24.1 C25.1 C27.1 C29.1 C30.1 CN1.1 CN2.1 D1.2 D6.2 D10.1 D11.1 FH9.2 Q6.3(S) Q7.3(S) R11.1 R23.1 R32.1 U8.3(GND) U10.5(GND)
GND: C1.1 C2.1 C3.1 C4.1 C5.2 C6.1 C7.1 C9.2 C11.1 C12.1 C14.2 C15.1 C16.1 C18.2 C21.2 C22.2 CN3.1(-) CN5.1 CN6.1 CN7.1 CN8.1 CN9.1 FH9.1 H1.1 H1.6 H2.4 H2.5 H2.7 H2.10 LED1.2(K) LED2.2(K) LED3.2(K) LED6.2(-) Q1.2(E) Q2.2(E) Q3.2(E) Q4.2(E) R2.1 R6.1 R13.2 R15.2 R28.2 SW3.3 U1.1(GND) U2.1(GND) U9.4(GND) ZD1.2(A) ZD2.2(A)
BAT: C1.2 C4.2 C6.2 C7.2 C9.1 C15.2 C16.2 C18.1 C20.2 C24.2 D4.2(A) FH2.1 FH3.1 FH4.1 FH5.1 FH6.1 R5.1 R9.2 R30.1 SW1.1 SW1.2 U1.3(VIN) U2.3(VIN) U8.6(VCC) U10.7(VCC)
BAT_IN: CN4.2(+) SW1.3 SW1.4
BAT_VOL: H2.2 R9.1 R13.1 U9.6(INB-)
CAP_OUT: D8.4 D9.4 FH1.2 U3.1 U3.4 U4.2 U4.3
CAP_VOL: C19.2 D1.1 H2.12 R7.1 R11.2 U9.3(INA+)
CHARGED: R8.1 R19.2 U9.1(OUTA)
CHARGING: Q4.1(B) R18.2 R28.1 R29.1
CHIP: D12.2(A) H2.6
CHIP_ISO: D12.1(C) R21.1 U8.2(INPUTA)
CHIP_VCC: D11.2 Q7.1(G) U8.7(OUTPUTA)
COIL_CHIP: D9.1 D9.3 Q7.4(D) U4.1 U4.4
COIL_SHOOT: D8.1 D8.3 Q6.4(D) U3.2 U3.3
CURRENT_CHARGE: C25.2 R25.2 U10.3(ISENSE)
FB_CHARGE: R23.2 R31.1 U10.2(VFB)
I2C1_SCL: CN5.2 CN6.2 CN7.2 CN8.2 CN9.3 H1.4
I2C1_SDA: CN5.3 CN6.3 CN7.3 CN8.3 CN9.4 H1.5
IR: CN9.2 H1.2
PWM_CHARGE: D7.1 Q5.1(G) R33.2 U10.6(OUT)
SHOOT: D13.2(A) H2.8
SHOOT_ISO: D13.1(C) R20.1 U8.4(INPUTB)
SHOOT_VCC: D10.2 Q6.1(G) U8.5(OUTPUTB)
VCAP+: C30.2 CN1.2 CN2.2 D5.1(C) FH1.1 R7.2 R31.2
VREF: R14.2 R15.1 U9.2(INA-) U9.5(INB+)
$1N34053: CN3.2(+) CN4.1(-)
$1N39970: LED1.1(A) R16.2
$1N40345: LED2.1(A) R17.1
$1N51147: R10.1 R12.1 U9.7(OUTB)
$1N51590: BUZZER1.2(-) Q1.3(C)
$1N51883: Q1.1(B) R12.2
$1N78137: CN6.5 FH3.2
$1N78301: CN5.5 FH2.2
$1N78465: CN7.5 FH4.2
$1N78629: CN8.5 FH5.2
$1N85806: R1.1 R2.2 U1.4(VFB)
$1N87289: C8.2 L2.1 U1.2(SW)
$1N87478: C8.1 U1.6(VBST)
$1N92062: C10.2 L1.1 U2.2(SW)
$1N92064: R3.1 R6.2 U2.4(VFB)
$1N96712: CN9.6 FH6.2
$1N100039: LED6.1(+) R18.1
$1N105558: C10.1 U2.6(VBST)
$1N110370: LED3.1(A) R19.1
$1N110625: R5.2 U2.5(EN)
$1N110769: R30.2 U1.5(EN)
$2N1842: Q2.3(C) Q3.3(C) Q4.3(C) U10.1(COMP)
$2N3782: C22.1 Q3.1(B) R21.2
$2N4437: C21.1 Q2.1(B) R20.2
$2N14178: D7.2 Q5.3(S) R25.1 R32.2 R33.1
$2N14601: D4.1(K) D6.1 L3.1
$2N15274: D5.2(A) L3.2 Q5.2(D)
$2N27199: C29.2 R27.1 U10.4(RT/CT)
$2N46490: R29.2 SW3.2

Not connected (* = marked no-connect by the designer): CN3 3 4; CN4 3 4; H1 3; SW3 4* 5* 6* 7*; U8 1(NC) 8(NC)
